# Altium schematic sheet MQ3.SchDoc
size A4; SheetNumber: 5; SheetTotal: 6
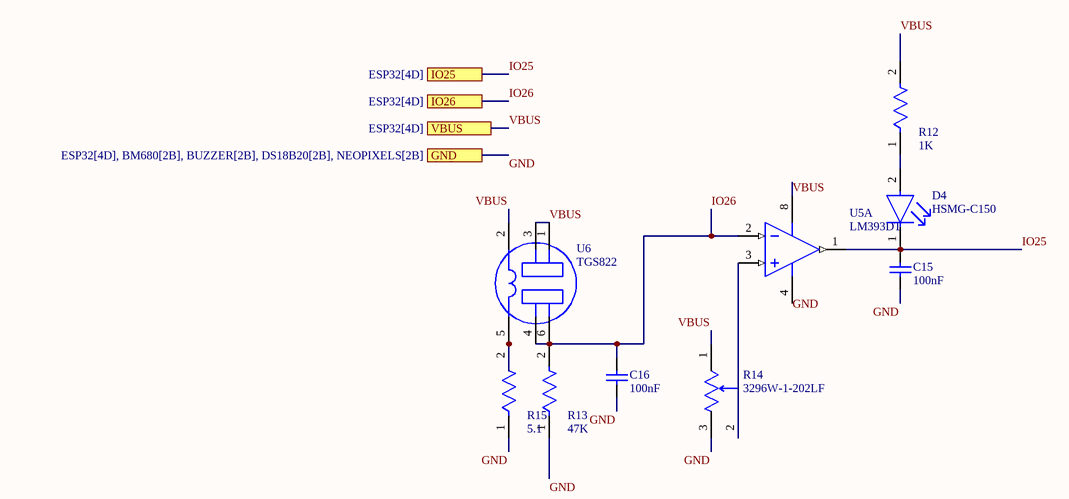
[diagram p0: MQ3.SchDoc]

## Parts
C15  100nF  [CAPC2013X140X50LL20T25]
C16  100nF  [CAPC2013X140X50LL20T25]
D4  HSMG-C150  [FP-HSMG-C150-MFG]
R12  1K  [FP-ERA6A-IPC_B]
R13  47K  [FP-ERA6A-IPC_A]
R14  3296W-1-202LF  [FP-3296W-MFG]
R15  5.1  [FP-ERA6A-IPC_A]
U5  LM393DT  [STM-SO-8_D_L]  (part A of 2)
U6  TGS822  [FP-TGS822-MFG]

## Ports
GND (see ESP32[4D], BM680[2B], BUZZER[2B], DS18B20[2B], NEOPIXELS[2B]), IO25 (see ESP32[4D]), IO26 (see ESP32[4D]), VBUS (see ESP32[4D])

## Nets
GND: C15.1 C16.1 R13.1 R14.3(CW) R15.1 U5.4(VCC-) ; port GND
IO25: C15.2 D4.1(C) U5.1(OUT1) ; port IO25
IO26: C16.2 R13.2 U5.2(IN1-) U6.4(VRL) U6.6(VRL) ; port IO26
VBUS: R12.2 R14.1(CCW) U5.8(VCC+) U6.1(VC) U6.2(VH) U6.3(VC) ; port VBUS
NetD4_2: D4.2(A) R12.1
NetR14_2: R14.2(WIPER) U5.3(IN1+)
NetR15_2: R15.2 U6.5(GND)

## Library data of the parts
C15 C16 = CMP-2007-03242-1: 10µF ±10% 16V Ceramic Capacitor X5R 0805 (2012 Metric); Part Number: CL21A106KOQNNNG
D4 = CMP-2000-05061-2: LED GREEN DIFFUSED 1206 SMD; Manufacturer: Broadcom; Led Orientation: Top View; Max Junction Temp: +95°C; Peak Emmision Wavelength: 570nm; Viewing Angle: 170°; Wavelength: 572nm; Reverse Voltage: 5V; Luminous Intensity: 15mcd; Forward Voltage: 2.2V; Power Dissipation: 65mW; Forward Current: 20mA; ComponentLink2Description: Datasheet; Lead Free: Yes; Temperature Range Low: -40°C; Package: HSMG-C150; Digikey Description: LED GREEN DIFFUSED 1206 SMD; Mouser Description: LED Uni-Color Green 570nm 2-Pin Chip LED T/R; Manufacturer Part Number: HSMG-C150; Temperature Range High: +85°C; Device Class L1: Optoelectronics; Colour: Green; Category: Diode; Device Class L3: unset; RoHS: TRUE; Height: 1.2mm; ComponentLink2URL: https://docs.broadcom.com/docs/AV02-0551EN; Device Class L2: LEDs; Automotive: No; Ipc Land Pattern Name: DIOCP320160X55; Octopart: https://octopart.com/hsmg-c150-broadcom-71131304; Temperature: -40°C to +85°C
R12 R13 R15 = CMP-2001-00583-2: RES 100K OHM 0.1% 1/8W 0805; Max Power Dissipation: 125mW; Voltage Rating: 100V; Resistance: 100kR; Temperature Coefficient: 25ppm/°C; Resistance Tolerance: 0.1%; Resistor Type: Thin Film; Mount: Surface Mount; Package Quantity: 1; RoHS Compliant: Yes; Features: Automotive AEC-Q200; Termination: Solder; Contact Plating: Tin; Number of Pins: 2; Construction: Rectangular; Size Code: 0805; Case/Package: 0805; Military Standard: Not; Voltage Rating (DC): 100V; Max Operating Temperature: 155°C; REACH SVHC: No SVHC; Series: ERA-6A; Case Code (Metric): 2012; Number of Terminations: 2; Tolerance: 0.1%; Width: 1.25mm; Depth: 1.25mm; Lead Free: Lead Free; Radiation Hardening: No; Length: 2mm; Technology: METAL FILM; Power Rating: 125mW; Min Operating Temperature: -55°C; Height: 0.5mm; Case Code (Imperial): 0805; Packaging: Tape and Reel
R14 = CMP-2000-05582-2: TRIMMER 2K OHM 0.5W PC PIN TOP; Resistance Tolerance: 10%; Max Power Dissipation: 500mW; Number of Turns: 25; Temperature Coefficient: 100ppm/°C; Resistance: 2kR; Taper: Linear; Width: 9.53mm; Radiation Hardening: No; Length: 9.53mm; Packaging: Rail/Tube; Lead Free: Lead Free; Mount: Panel; Min Operating Temperature: -55°C; Power Rating: 500mW; RoHS Compliant: Yes; REACH SVHC: No SVHC; Color: Blue; Package Quantity: 50; Contact Plating: Tin; Weight: 0.03oz; Technology: CERMET; Max Operating Temperature: 125°C; Tolerance: 10%; Termination: Pin; Resistor Type: Cermet; Military Standard: Not; Height: 0.395inch; Series: 3296; Depth: 4.83mm
U5 = CMP-2000-06550-1: Low-Power, Dual-Voltage Comparator, 2 to 36 V, 0 to 70 degC, 8-Pin SOIC (SO), RoHS, Tape and Reel; Manufacturer: STMicroelectronics; Voltage - Supply, Single/Dual (±): 2V~36V,±1V~18V; Current - Input Bias (Max): 0.25µA@5V; Number of Elements: 2; Current - Output (Typ): 18mA@5V; Other Names: 497-1593-2; Voltage - Input Offset (Max): 5mV@30V; Output Type: CMOS,DTL,ECL,MOS,Open-Collector,TTL; EDA / CAD Models: DownloadfromAcceleratedDesigns; Other Related Documents: LM393ViewAllSpecificationsLM393ViewAllSpecifications; Online Catalog: Comparators-2elements; Current - Quiescent (Max): 2.5mA; Standard Package: 2,500; Manufacturer URL: http://www.st.com/; Package Description: 8-Pin Small Outline Integrated Circuit, Body 4.9 x 3.9 mm, Pitch 1.27 mm; Packaging: Tape&Reel(TR); Datasheet Version: Rev. 15, 02/2016; Category: IntegratedCircuits(ICs); Operating Temperature: 0°C~70°C; Mounting Type: SurfaceMount; Supplier Device Package: 8-SO; Datasheet URL: http://www.st.com/content/ccc/resource/technical/document/datasheet/group1/b4/cc/cf/13/18/28/44/f5/CD00000465/files/CD00000465.pdf/jcr:content/translations/en.CD00000465.pdf; Family: Linear-Comparators; Mounting Technology: SurfaceMount; Type: GeneralPurpose; Package Reference: SO-8; Package / Case: 8-SOIC(0.154",3.90mmWidth)
U6 = CMP-04312-24208239-1: TGS822 MOS-Type organic solvent vapors sensor; range: 50-5000ppm C2H5OH; supply: 5V; power: 660mW; Max Supply Voltage: 24V; NexarPartId: 24208239; Height: 10mm; RoHS: Compliant; Case/Package: Radial